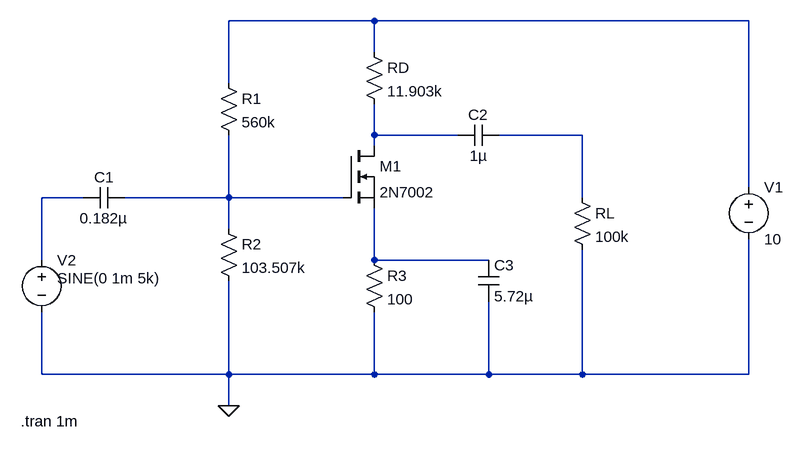
[diagram p0: schematic NNM24EE029_Bhuvan.asc]
NNM24EE029_Bhuvan.asc, the LTspice schematic file:
Version 4.1
SHEET 1 1680 680
WIRE 176 -96 -48 -96
WIRE 752 -96 176 -96
WIRE 176 -48 176 -96
WIRE -48 0 -48 -96
WIRE 176 80 176 32
WIRE 304 80 176 80
WIRE 496 80 368 80
WIRE 176 96 176 80
WIRE 752 160 752 -96
WIRE -272 176 -336 176
WIRE -48 176 -48 80
WIRE -48 176 -208 176
WIRE 128 176 -48 176
WIRE 496 176 496 80
WIRE -48 224 -48 176
WIRE -336 272 -336 176
WIRE 176 272 176 192
WIRE 352 272 176 272
WIRE -336 448 -336 352
WIRE -48 448 -48 304
WIRE -48 448 -336 448
WIRE 176 448 176 352
WIRE 176 448 -48 448
WIRE 352 448 352 336
WIRE 352 448 176 448
WIRE 496 448 496 256
WIRE 496 448 352 448
WIRE 752 448 752 240
WIRE 752 448 496 448
WIRE -48 496 -48 448
FLAG -48 496 0
SYMBOL res -64 -16 R0
SYMATTR InstName R1
SYMATTR Value 560k
SYMBOL res -64 208 R0
SYMATTR InstName R2
SYMATTR Value 103.507k
SYMBOL res 160 -64 R0
SYMATTR InstName RD
SYMATTR Value 11.903k
SYMBOL res 480 160 R0
SYMATTR InstName RL
SYMATTR Value 100k
SYMBOL cap 304 96 R270
WINDOW 0 32 32 VTop 2
WINDOW 3 0 32 VBottom 2
SYMATTR InstName C2
SYMATTR Value 1µ
SYMBOL voltage -336 256 R0
WINDOW 123 24 124 Left 2
WINDOW 39 0 0 Left 0
WINDOW 3 24 44 Left 2
SYMATTR Value SINE(0 1m 5k)
SYMATTR InstName V2
SYMBOL res 160 256 R0
SYMATTR InstName R3
SYMATTR Value 100
SYMBOL voltage 752 144 R0
SYMATTR InstName V1
SYMATTR Value 10
SYMBOL cap -272 192 R270
WINDOW 0 32 32 VTop 2
WINDOW 3 0 32 VBottom 2
SYMATTR InstName C1
SYMATTR Value 0.182µ
SYMBOL nmos 128 96 R0
SYMATTR InstName M1
SYMATTR Value 2N7002
SYMBOL cap 336 272 R0
SYMATTR InstName C3
SYMATTR Value 5.72µ
TEXT -368 520 Left 2 !.tran 1m

The netlist it stands for:
* NNM24EE029_Bhuvan.asc
R1 N001 N005 560k
R2 N005 0 103.507k
RD N001 N002 11.903k
RL N003 0 100k
C2 N002 N003 1µ
V2 N004 0 SINE(0 1m 5k)
R3 N006 0 100
V1 N001 0 10
C1 N004 N005 0.182µ
M1 N002 N005 N006 N006 2N7002
C3 N006 0 5.72µ
.model NMOS NMOS
.model PMOS PMOS
.lib standard.mos
.tran 1m
.backanno
.end